# Altium schematic sheet Audio.SchDoc: Dahlia Carrier Board
size A3; Organization: Toradex AG; Address1: Ebenaustrasse 10; Address2: Horw; Address3: 6048; Address4: Switzerland; DocumentNumber: 15; Revision: V1.1; SheetNumber: 15; SheetTotal: 21; PageSetup: Record=PageOptions|CenterHorizontal=True|CenterVertical=True|PrintScale=0.71|XCorrection=1.00|YCorrection=1.00|PrintKind=1|BorderSize=5000000|LeftOffset=0|BottomOffset=0|Orientation=2|PaperLength=1000|PaperWidth=1000|Scale=100|PaperSource=15|PrintQuality=600|MediaType=1|DitherType=10|PaperKind=A4|PrintScaleMode=1
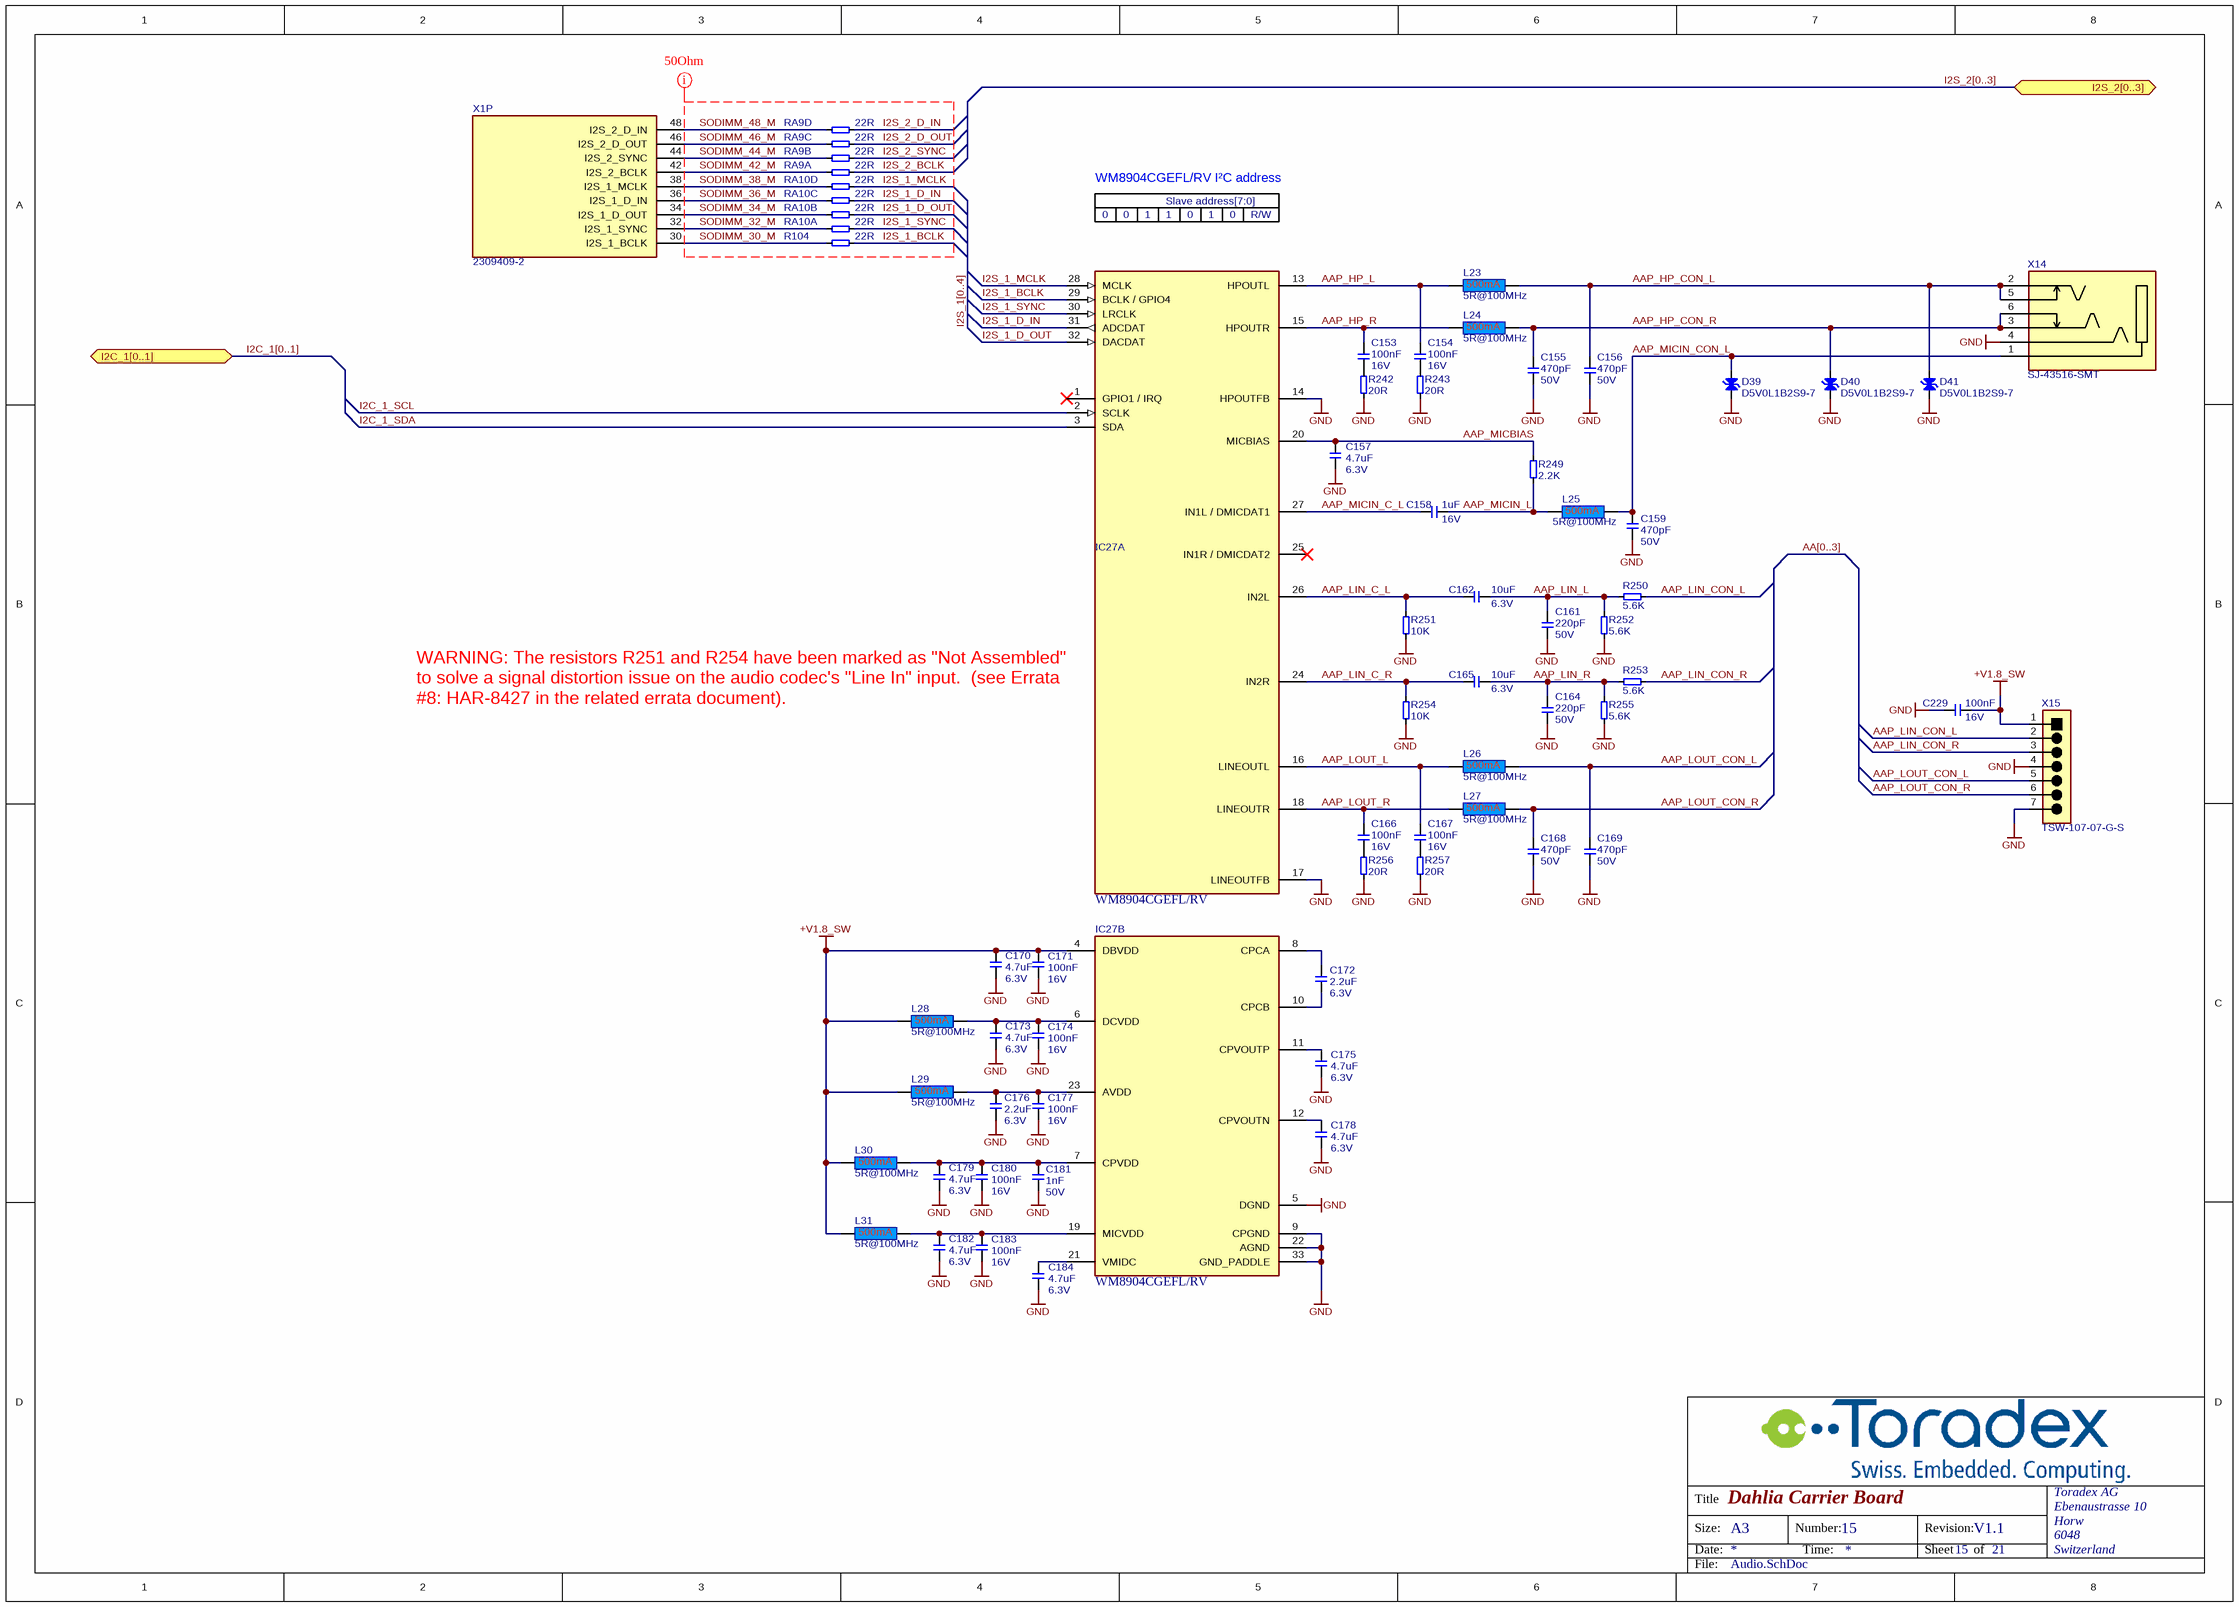
[diagram p0: Audio.SchDoc]

## Parts
C153  Rating: 16V  [CAPC1005X60N]  (hidden comment: 100nF)
C154  Rating: 16V  [CAPC1005X60N]  (hidden comment: 100nF)
C155  Rating: 50V  [CAPC1005X60N]  (hidden comment: 470pF)
C156  Rating: 50V  [CAPC1005X60N]  (hidden comment: 470pF)
C157  Rating: 6.3V  [CAPC1005X60N]  (hidden comment: 4.7uF)
C158  Rating: 16V  [CAPC1005X60N]  (hidden comment: 1uF)
C159  Rating: 50V  [CAPC1005X60N]  (hidden comment: 470pF)
C161  Rating: 50V  [CAPC1005X60N]  (hidden comment: 220pF)
C162  Rating: 6.3V  [CAPC1005X60N]  (hidden comment: 10uF)
C164  Rating: 50V  [CAPC1005X60N]  (hidden comment: 220pF)
C165  Rating: 6.3V  [CAPC1005X60N]  (hidden comment: 10uF)
C166  Rating: 16V  [CAPC1005X60N]  (hidden comment: 100nF)
C167  Rating: 16V  [CAPC1005X60N]  (hidden comment: 100nF)
C168  Rating: 50V  [CAPC1005X60N]  (hidden comment: 470pF)
C169  Rating: 50V  [CAPC1005X60N]  (hidden comment: 470pF)
C170  Rating: 6.3V  [CAPC1005X60N]  (hidden comment: 4.7uF)
C171  Rating: 16V  [CAPC1005X60N]  (hidden comment: 100nF)
C172  Rating: 6.3V  [CAPC1005X60N]  (hidden comment: 2.2uF)
C173  Rating: 6.3V  [CAPC1005X60N]  (hidden comment: 4.7uF)
C174  Rating: 16V  [CAPC1005X60N]  (hidden comment: 100nF)
C175  Rating: 6.3V  [CAPC1005X60N]  (hidden comment: 4.7uF)
C176  Rating: 6.3V  [CAPC1005X60N]  (hidden comment: 2.2uF)
C177  Rating: 16V  [CAPC1005X60N]  (hidden comment: 100nF)
C178  Rating: 6.3V  [CAPC1005X60N]  (hidden comment: 4.7uF)
C179  Rating: 6.3V  [CAPC1005X60N]  (hidden comment: 4.7uF)
C180  Rating: 16V  [CAPC1005X60N]  (hidden comment: 100nF)
C181  Rating: 50V  [CAPC1005X60N]  (hidden comment: 1nF)
C182  Rating: 6.3V  [CAPC1005X60N]  (hidden comment: 4.7uF)
C183  Rating: 16V  [CAPC1005X60N]  (hidden comment: 100nF)
C184  Rating: 6.3V  [CAPC1005X60N]  (hidden comment: 4.7uF)
C229  Rating: 16V  [CAPC1005X60N]  (hidden comment: 100nF)
D39  D5V0L1B2S9-7  [D-DIODES-SOD-923]
D40  D5V0L1B2S9-7  [D-DIODES-SOD-923]
D41  D5V0L1B2S9-7  [D-DIODES-SOD-923]
IC27  WM8904CGEFL/RV  [IC-QFN40P400X400X80_HS-33N]  (parts A,B of 2)
L23  5R@100MHz  [INDC1005X60N]
L24  5R@100MHz  [INDC1005X60N]
L25  5R@100MHz  [INDC1005X60N]
L26  5R@100MHz  [INDC1005X60N]
L27  5R@100MHz  [INDC1005X60N]
L28  5R@100MHz  [INDC1005X60N]
L29  5R@100MHz  [INDC1005X60N]
L30  5R@100MHz  [INDC1005X60N]
L31  5R@100MHz  [INDC1005X60N]
R104  22R  [RESC1005X40N]
R242  20R  [RESC1005X40N]
R243  20R  [RESC1005X40N]
R249  2.2K  [RESC1005X40N]
R250  5.6K  [RESC1005X40N]
R251  10K  [RESC1005X40N]
R252  5.6K  [RESC1005X40N]
R253  5.6K  [RESC1005X40N]
R254  10K  [RESC1005X40N]
R255  5.6K  [RESC1005X40N]
R256  20R  [RESC1005X40N]
R257  20R  [RESC1005X40N]
RA9  22R  [T_Resistor_Array_X4]  (parts A,B,C,D of 4)
RA10  22R  [T_Resistor_Array_X4]  (parts A,B,C,D of 4)
X1  2309409-2  [CON-TE-2309409-2-SOLDERABLE-STANDOFFS]  (part P of 23)
X14  SJ-43516-SMT  [T_CI_SJ-43516-SMT]
X15  TSW-107-07-G-S  [T_Samtec_TSW-107-07-G-S]

## Ports
I2C_1[0..1] (bidir), I2S_2[0..3] (bidir)

## Nets
+V1.8_SW: C170.2 C171.2 C229.1 IC27.4(DBVDD) L28.1 L29.1 L30.1 L31.1 X15.1
GND: C155.1 C156.1 C157.1 C159.1 C161.1 C164.1 C168.1 C169.1 C170.1 C171.1 C173.1 C174.1 C175.1 C176.1 C177.1 C178.1 C179.1 C180.1 C181.1 C182.1 C183.1 C184.1 C229.2 D39.1(C) D40.1(C) D41.1(C) IC27.5(DGND) IC27.9(CPGND) IC27.14(HPOUTFB) IC27.17(LINEOUTFB) IC27.22(AGND) IC27.33(GND_PADDLE) R242.1 R243.1 R251.1 R252.1 R254.1 R255.1 R256.1 R257.1 X14.4 X15.4 X15.7
AAP_HP_CON_L: C156.2 D41.2(A) L23.2 X14.2 X14.5
AAP_HP_CON_R: C155.2 D40.2(A) L24.2 X14.3 X14.6
AAP_HP_L: C154.2 IC27.13(HPOUTL) L23.1
AAP_HP_R: C153.2 IC27.15(HPOUTR) L24.1
AAP_LIN_C_L: C162.2 IC27.26(IN2L) R251.2
AAP_LIN_C_R: C165.2 IC27.24(IN2R) R254.2
AAP_LIN_CON_L: R250.1 X15.2
AAP_LIN_CON_R: R253.1 X15.3
AAP_LIN_L: C161.2 C162.1 R250.2 R252.2
AAP_LIN_R: C164.2 C165.1 R253.2 R255.2
AAP_LOUT_CON_L: C169.2 L26.2 X15.5
AAP_LOUT_CON_R: C168.2 L27.2 X15.6
AAP_LOUT_L: C167.2 IC27.16(LINEOUTL) L26.1
AAP_LOUT_R: C166.2 IC27.18(LINEOUTR) L27.1
AAP_MICBIAS: C157.2 IC27.20(MICBIAS) R249.2
AAP_MICIN_C_L: C158.1 IC27.27(IN1L_/_DMICDAT1)
AAP_MICIN_CON_L: C159.2 D39.2(A) L25.2 X14.1
AAP_MICIN_L: C158.2 L25.1 R249.1
I2C_1_SCL: IC27.2(SCLK)
I2C_1_SDA: IC27.3(SDA)
I2S_1_BCLK: IC27.29(BCLK_/_GPIO4) R104.2
I2S_1_D_IN: IC27.31(ADCDAT) RA10.7
I2S_1_D_OUT: IC27.32(DACDAT) RA10.6
I2S_1_MCLK: IC27.28(MCLK) RA10.8
I2S_1_SYNC: IC27.30(LRCLK) RA10.5
I2S_2_BCLK: RA9.5
I2S_2_D_IN: RA9.8
I2S_2_D_OUT: RA9.7
I2S_2_SYNC: RA9.6
SODIMM_30_M: R104.1 X1.30(I2S_1_BCLK)
SODIMM_32_M: RA10.1 X1.32(I2S_1_SYNC)
SODIMM_34_M: RA10.2 X1.34(I2S_1_D_OUT)
SODIMM_36_M: RA10.3 X1.36(I2S_1_D_IN)
SODIMM_38_M: RA10.4 X1.38(I2S_1_MCLK)
SODIMM_42_M: RA9.1 X1.42(I2S_2_BCLK)
SODIMM_44_M: RA9.2 X1.44(I2S_2_SYNC)
SODIMM_46_M: RA9.3 X1.46(I2S_2_D_OUT)
SODIMM_48_M: RA9.4 X1.48(I2S_2_D_IN)
NetC153_1: C153.1 R242.2
NetC154_1: C154.1 R243.2
NetC166_1: C166.1 R256.2
NetC167_1: C167.1 R257.2
NetC172_1: C172.1 IC27.10(CPCB)
NetC172_2: C172.2 IC27.8(CPCA)
NetC173_2: C173.2 C174.2 IC27.6(DCVDD) L28.2
NetC175_2: C175.2 IC27.11(CPVOUTP)
NetC176_2: C176.2 C177.2 IC27.23(AVDD) L29.2
NetC178_2: C178.2 IC27.12(CPVOUTN)
NetC179_2: C179.2 C180.2 C181.2 IC27.7(CPVDD) L30.2
NetC182_2: C182.2 C183.2 IC27.19(MICVDD) L31.2
NetC184_2: C184.2 IC27.21(VMIDC)

Not connected (* = marked no-connect by the designer): IC27 1(GPIO1_/_IRQ)* 25(IN1R_/_DMICDAT2)*

## Buses and harness runs
bus AA[0..3]
bus I2C_1[0..1] = port I2C_1[0..1]
bus I2S_1[0..4]
bus I2S_2[0..3] = port I2S_2[0..3]

## Layout directives
net class 50Ohm: I2S_1_BCLK, I2S_1_D_IN, I2S_1_D_OUT, I2S_1_MCLK, I2S_1_SYNC, I2S_2_BCLK, I2S_2_D_IN, I2S_2_D_OUT, I2S_2_SYNC, SODIMM_30_M, SODIMM_32_M, SODIMM_34_M, SODIMM_36_M, SODIMM_38_M, SODIMM_42_M, SODIMM_44_M, SODIMM_46_M, SODIMM_48_M

## Notes on the sheet
- WM8904CGEFL/RV I²C address
- Slave address[7:0]
- 0
- 1
- R/W
- (near IC27) WARNING: The resistors R251 and R254 have been marked as "Not Assembled" to solve a signal distortion issue on the audio codec's "Line In" input.  (see Errata #8: HAR-8427 in the related errata document).
- Title
- Size:
- Date:
- A3
- Number:
- Time:
- Revision:
- Sheet
- of
- File:

## Library data of the parts
C153 C154 C166 C167 C171 C174 C177 C180 C183 C229 = C-X7R-100nF-16V-10%-0402: Capacitor Ceramic X7R 100nF 16V 10% 0402; Tolerance: 10%; Type: X7R; Value: 100nF
C155 C156 C159 C168 C169 = C-X7R-470p-50V-10%-0402: Capacitor Ceramic X7R 470pF 50V 10% 0402; Tolerance: 10%; Type: X7R; Value: 470pF
C157 C170 C173 C175 C178 C179 C182 C184 = C-X5R-4.7u-6.3V-20%-0402: Capacitor Ceramic X5R 4.7uF 6.3V 20% 0402; Tolerance: 20%; Type: X5R; Value: 4.7uF
C158 = C-X5R-1uF-16V-20%-0402: Capacitor Ceramic X5R 1uF 16V 20% 0402; Tolerance: 20%; Type: X5R; Value: 1uF
C161 C164 = C-X7R-220pF-50V-10%-0402: Capacitor Ceramic X7R  220pF 50V 10% 0402; Tolerance: 10%; Type: X7R; Value: 220pF
C162 C165 = C-X5R-10u-6.3V-20%-0402: Capacitor Ceramic X5R 10uF 6.3V 20% 0402; Tolerance: 20%; Type: X5R; Value: 10uF
C172 C176 = C-X5R-2.2u-6.3V-20%-0402: Capacitor Ceramic X5R 2.2uF 6.3V 20% 0402; Tolerance: 20%; Type: X5R; Value: 2.2uF
C181 = C-X7R-1nF-50V-10%-0402: Capacitor Ceramic X7R 1nF 50V 10% 0402; Tolerance: 10%; Type: X7R; Value: 1nF
D39-D41 = D-Diodes-D5V0L1B2S9-7: BIDIRECTIONAL TVS DIODE 5V  SOD923; Manufacturer Name: Diodes; Manufacturer Part No.: D5V0L1B2S9-7
IC27 = IC-CIRRUS-WM8904CGEFL/RV: Stereo Audio Interface IC; Manufacturer Name: CIRRUS; Package: *; Temperature Range: *; Manufacturer Part No.: WM8904CGEFL/RV
L23-L31 = Lemv-5R-500mA-25%-0402: 5R@100MHz 500mA EMI FILTER; Manufacturer Part No.: BLM15BB050SN1D; Manufacturer: Murata; Tolerance: 25%; Rating: 500mA; Value: 5R@100MHz
R104 = R-22R-63mW-5%-0402: Resistor 22 ohm 63mW 5% 0402; Rating: 63mW; Tolerance: 5%; Value: 22R
R242 R243 R256 R257 = R-20R-63mW-5%-0402: Resistor 20 ohm 63mW 5% 0402; Rating: 63mW; Tolerance: 5%; Value: 20R
R249 = R-2.2K-63mW-5%-0402: Resistor 2.2 Kohm 63mW 5% 0402; Value: 2.2KR; Rating: 63mW; Tolerance: 5%
R250 R252 R253 R255 = R-5.6K-63mW-5%-0402: Resistor 5.6 Kohm 63mW 5% 0402; Value: 5.6KR; Rating: 63mW; Tolerance: 5%
R251 R254 = R-10K-63mW-5%-0402: Resistor 10 Kohm 63mW 5% 0402; Rating: 63mW; Tolerance: 5%; Value: 10K
RA9 RA10 = RA-22R-63mW-5%-1206-div: Resistor Array 22 R 63mW 5% 1206; Tolerance: 5%; Power Dissipation: 63mW; Value: 22R
X1 = CON-TE-2309409-2: DDR4 SODIMM Socket, 260 pins, 5.2mm(H), 0.5mm Pitch; Manufacturer Name: TE; Temperature Range: -40C to +125C; Package: DDR4-SODIMM-260; Manufacturer Part No.: 2309409-2
X14 = CON-Cui-SJ-43516-SMT-6-3.5mm: 3.5mm Stereo Jack SMD With Detect Contact; Manufacturer Name: Cui INC; No. of ways: 6; Manufacturer Part No.: SJ-43516-SMT
X15 = CON-Samtec-TSW-107-07-G-S: Header male, 1X7 Pins, 2.54 mm pitch; Manufacturer Name: Samtec; Pitch: 2.54 mm; No. of ways: 1X7; Manufacturer Part No.: TSW-107-07-G-S